# Altium schematic sheet USER_IO.SchDoc
size A; SheetNumber: 5; SheetTotal: 7
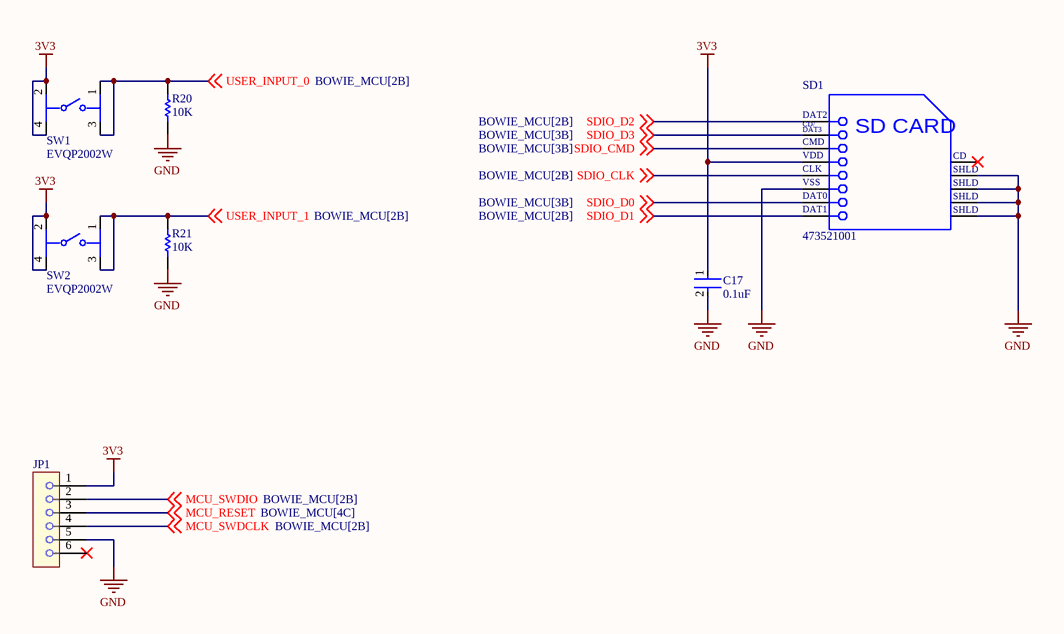
[diagram p0: USER_IO.SchDoc]

## Parts
C17  0.1uF  [FP-GRM15-MFG]
JP1  TC2030-6-NL-FOOTPRINT  [TAG_TC2030_NL_6]  (value not drawn)  (no BOM)
R20  10K  [RESC1005X40X25ML05T10]
R21  10K  [RESC1005X40X25ML05T10]
SD1  473521001  [MOLX-473521001_V]
SW1  EVQP2002W  [FP-EVQP2002W-MFG]
SW2  EVQP2002W  [FP-EVQP2002W-MFG]

## Nets
3V3: C17.1 JP1.1 SD1.4(VDD) SW1.2 SW1.4 SW2.2 SW2.4
GND: C17.2 JP1.5 R20.1 R21.1 SD1.6(VSS) SD1.10(SHLD) SD1.11(SHLD) SD1.12(SHLD) SD1.13(SHLD)
MCU_RESET: JP1.3 ; off-sheet MCU_RESET
MCU_SWDCLK: JP1.4 ; off-sheet MCU_SWDCLK
MCU_SWDIO: JP1.2 ; off-sheet MCU_SWDIO
SDIO_CLK: SD1.5(CLK) ; off-sheet SDIO_CLK
SDIO_CMD: SD1.3(CMD) ; off-sheet SDIO_CMD
SDIO_D0: SD1.7(DAT0) ; off-sheet SDIO_D0
SDIO_D1: SD1.8(DAT1) ; off-sheet SDIO_D1
SDIO_D2: SD1.1(DAT2) ; off-sheet SDIO_D2
SDIO_D3: SD1.2(CD/DAT3) ; off-sheet SDIO_D3
USER_INPUT_0: R20.2 SW1.1 SW1.3 ; off-sheet USER_INPUT_0
USER_INPUT_1: R21.2 SW2.1 SW2.3 ; off-sheet USER_INPUT_1

Not connected (* = marked no-connect by the designer): JP1 6*; SD1 9(CD)*

## Notes on the sheet
- (in symbol CMP-2000-05848-1) CD/; DAT3; SD CARD

## Library data of the parts
C17 = CMP-2100-03641-2: CAP CER 0.1UF 16V X7R 0402; Manufacturer Part Number: GRM155R71C104KA88D; Manufacturer: Murata; Standoff Height: 0mm; Tolerance: 10%; Voltage Rating: 16Vdc; Material: Ceramic; Capacitance: 0.10μF; Value: 0.10μF; RoHS: TRUE; Temperature Characteristic: X7R; Octopart: https://octopart.com/grm155r71c104ka88d-murata-196880; Digikey Description: CAP CER 0.1UF 16V X7R 0402; Device Class L3: Ceramic Capacitors; Height: 0.55mm; ComponentLink2Description: Datasheet; Temperature Range Low: -55°C; Ipc Land Pattern Name: CAPC10050X219; ComponentLink2URL: https://search.murata.co.jp/Ceramy/image/img/A01X/G101/ENG/GRM155R71H471KA01-01A.pdf; Device Class L1: Passive Components; Lead Free: yes; Category: Cap; Package: GRM15; Temperature: -55°C to +125°C; Device Class L2: Capacitors; Temperature Range High: +125°C; Mouser Description: 0402 0.1 uF 16V ±10 % Tolerance X7R SMT Multilayer Ceramic Capacitor
JP1 = TC2030-6-NL-FOOTPRINT: CONN, FP, 2X3, .05, DEBUG, SMT; Manufacturer: NO PART; Part Number: FOOTPRINT ONLY
R20 R21 = CMP-2002-03043-1: Part Number: CRCW040210K0FKEDHP; Manufacturer: Vishay Dale
SD1 = CMP-2000-05848-1: MicroSD(TM), Pitch 1.1 mm, 8 Position, Height 1.88 mm, -20 to 85 degC, RoHS, Tape and Reel; Manufacturer: Molex; Datasheet Version: Rev. G, 01/2012; Datasheet URL: http://www.molex.com/pdm_docs/sd/473521001_sd.pdf; Package Reference: 473521001; Manufacturer URL: http://www.molex.com/; Mounting Technology: SurfaceMount; Package Description: MicroSD(TM), Pitch 1.1 mm, 8 Position, Height 1.88 mm
SW1 SW2 = CMP-05618-000142-1: SWITCH TACTILE SPST-NO 0.02A 15V; Throw Configuration: SPST; Electrical Life: 1000000Cycles; Contact Current Rating: 20mA; Actuator Color: Natural; Contact Resistance: 100mR; Switch Travel: 0.25mm; Illumination Type: Non-Illuminated; Operating Force: 1N; Actuator Length: 0.85mm; Switch Function: Off-Mom; RoHS Compliant: Yes; Height: 2.5mm; Termination: J-Bend; Size: 3.5mm; Min Operating Temperature: -40°C; Contact Plating: Silver; Orientation: Straight; Package Quantity: 1; Voltage Rating (DC): 15V; Mount: Surface Mount; Mechanical Life: 1000000Cycles; Packaging: Tape and Reel; Max Current Rating: 20mA; Current Rating: 20mA; Length: 3.5mm; Radiation Hardening: No; Max Operating Temperature: 85°C; Lead Free: Lead Free; REACH SVHC: No SVHC; Depth: 5.5mm; Max Voltage Rating (DC): 15V; Series: EVQP2